# Altium project Metlino.PrjPcb (part 9 of 13)

## Sheet CPU_LPC1776.SchDoc: Metlino
size 420 x 297 mm; CheckedBy: P.Kulik,T.Przywozki,W.Ruclo; Author: G.Kasprowicz; CompanyName: WUT ISE; DrawnBy: G.Kasprowicz; Organization: WUT ISE; Address1: PW ISE; Address2: Nowowiejska 15/19 00-665 Warsaw; Address3: gkasprow@gmail.com; DocumentNumber: 26; Revision: 2; SheetNumber: 26; SheetTotal: 29; ModifiedBy: -; CheckedDate: -; Title2: MMC IO ports; DivGrp: WUT ISE; Designer: G.Kasprowicz; ModifiedDate: -; ProjectName: Sensor Box
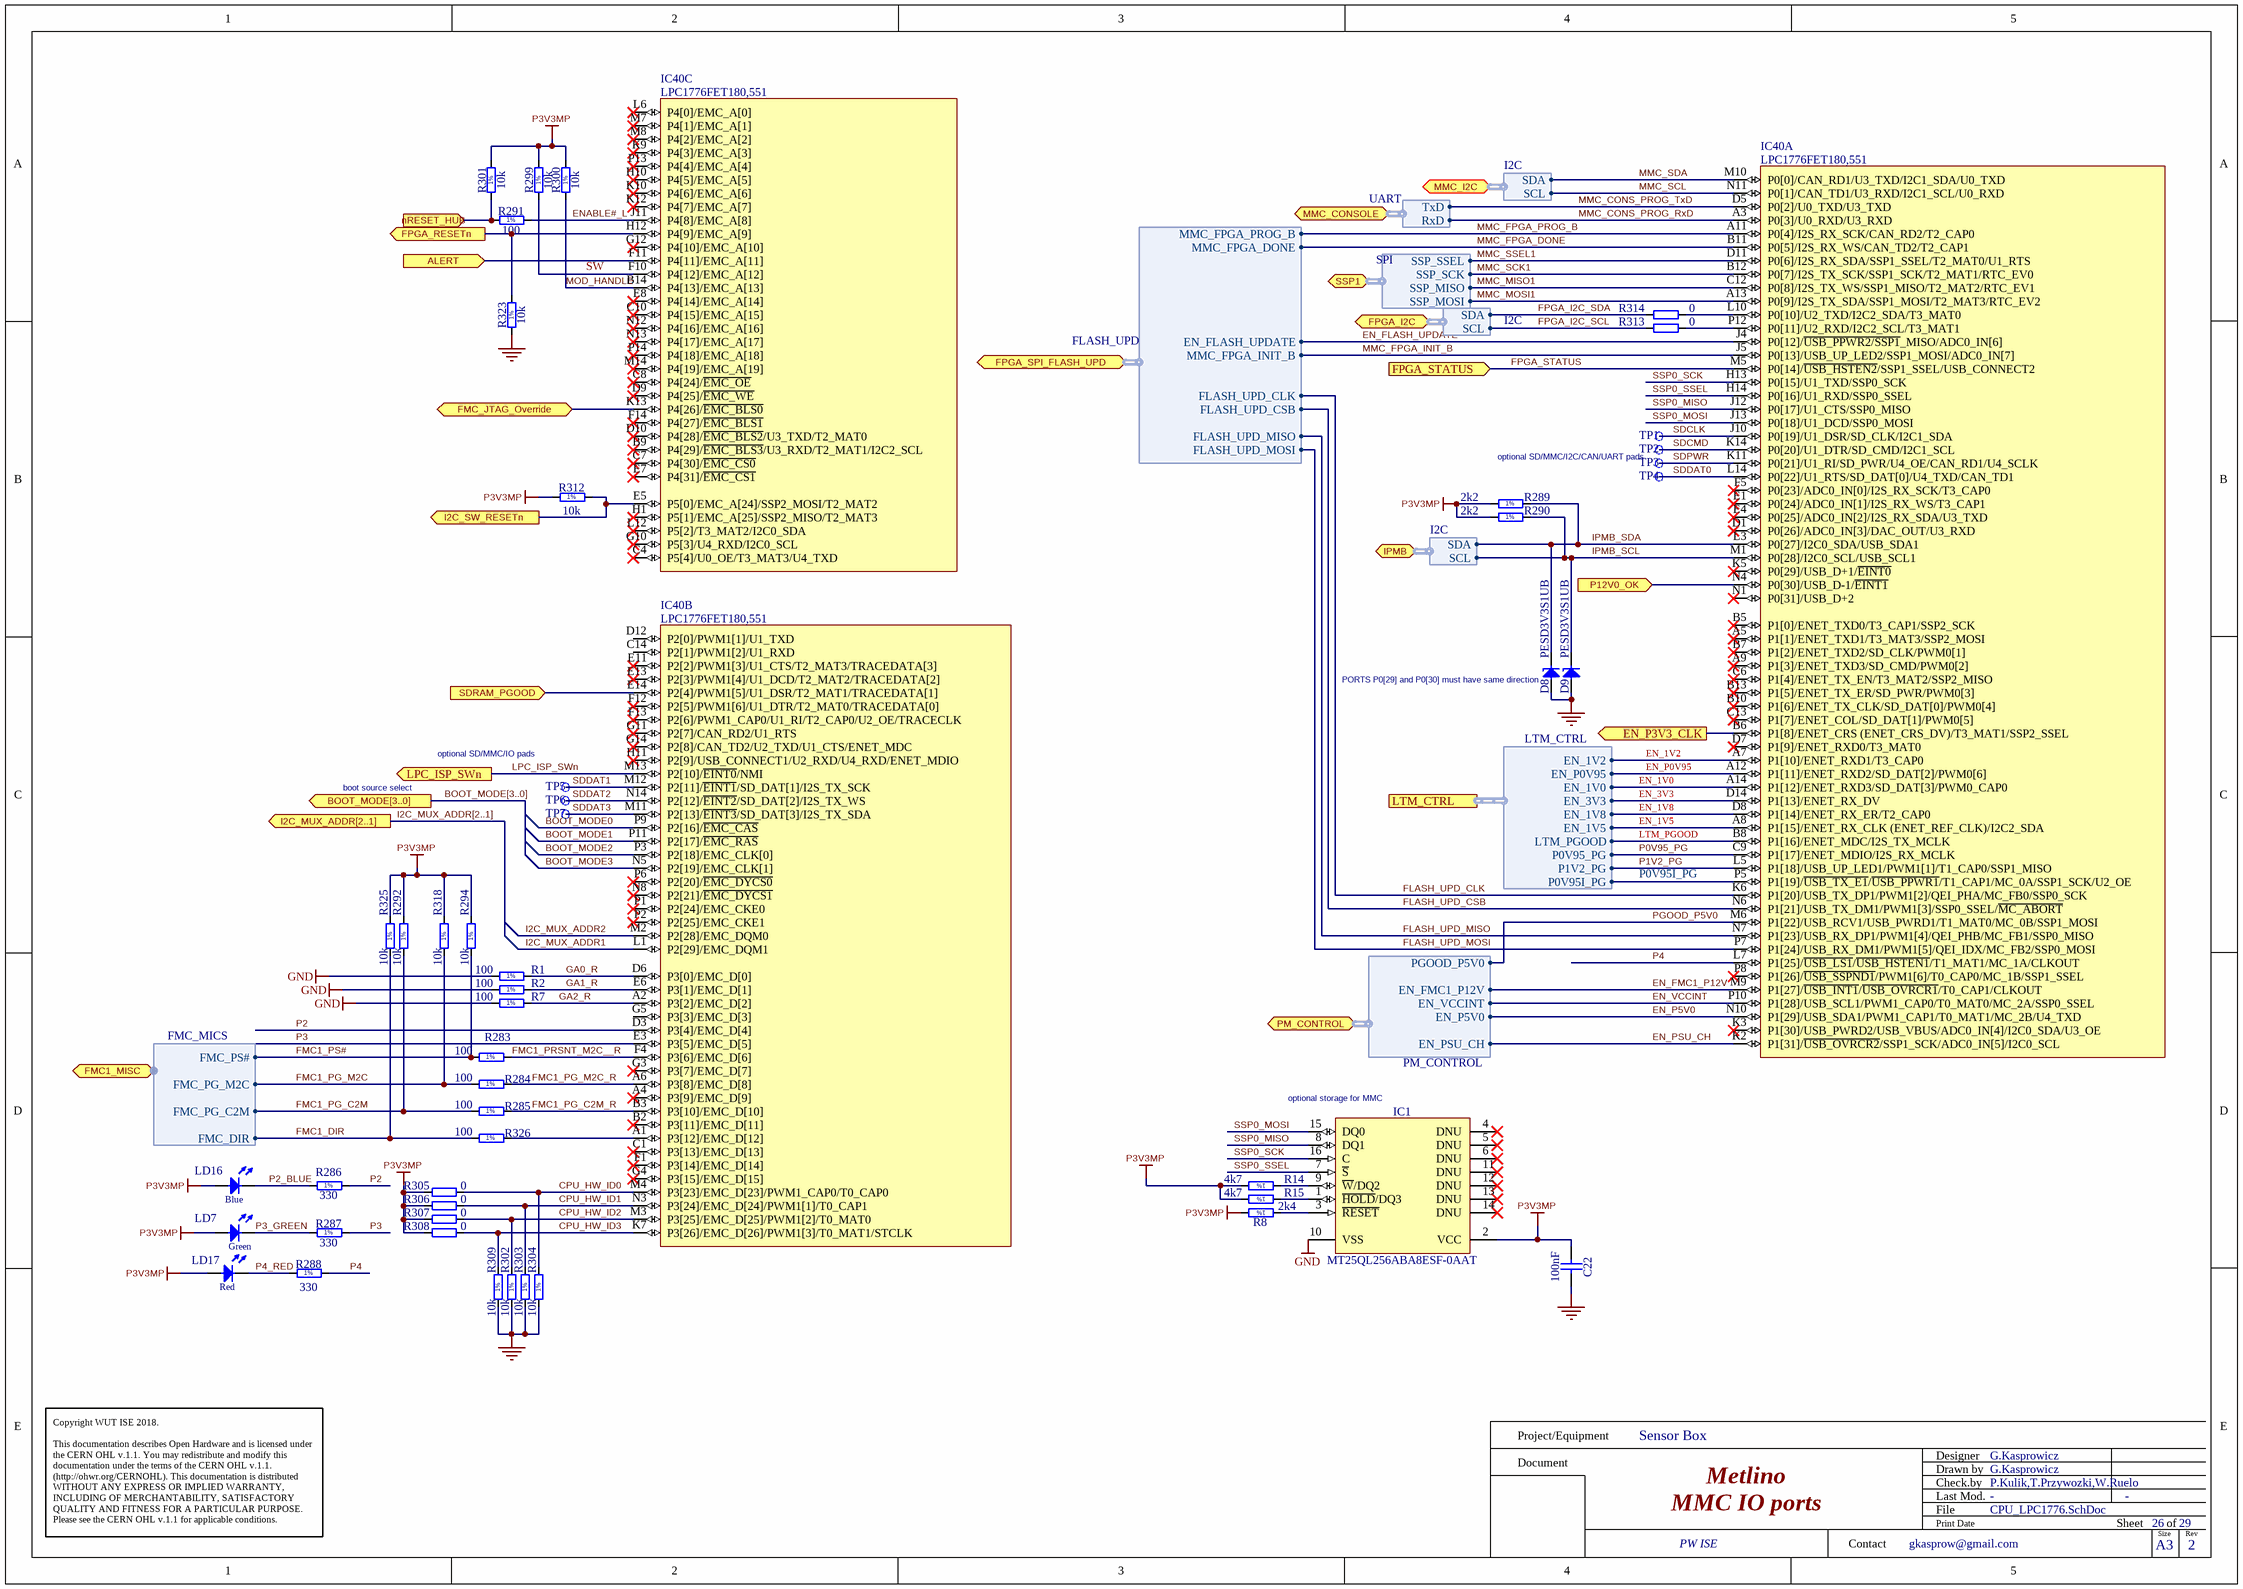
[diagram p18: CPU_LPC1776.SchDoc]

### Parts
C22  100nF  [CAPC0603X33N]
D8  PESD3V3S1UB  [SODFL1608X65N]
D9  PESD3V3S1UB  [SODFL1608X65N]
IC1  MT25QL256ABA8ESF-0AAT  [SOIC127P1030X265-16N]
IC40  LPC1776FET180,551  [BGA180C80P14X14_1200X1200X120]  (parts A,B,C of 5)
LD7  Green  [LED_AVAGO_HSME-C120]
LD16  Blue  [LED_AVAGO_HSMR-C120]  (value not drawn)
LD17  Red  [LED_KINGBRIGHT_KPH-1608SURCK]
R1  100  [RESC1005X40N]
R2  100  [RESC1005X40N]
R7  100  [RESC1005X40N]
R8  2k4  [RESC1005X40N]
R14  4k7  [RESC1005X40N]
R15  4k7  [RESC1005X40N]
R283  100  [RESC1005X40N]
R284  100  [RESC1005X40N]
R285  100  [RESC1005X40N]
R286  330  [RESC1005X40N]
R287  330  [RESC1005X40N]
R288  330  [RESC1005X40N]
R289  2k2  [RESC1005X40N]
R290  2k2  [RESC1005X40N]
R291  100  [RESC1005X40N]
R292  10k  [RESC1005X40N]
R294  10k  [RESC1005X40N]
R299  10k  [RESC1005X40N]
R300  10k  [RESC1005X40N]
R301  10k  [RESC1005X40N]
R302  10k  [RESC1005X40N]
R303  10k  [RESC1005X40N]
R304  10k  [RESC1005X40N]
R305  0  [RESC1005X40N]
R306  0  [RESC1005X40N]
R307  0  [RESC1005X40N]
R308  0  [RESC1005X40N]
R309  10k  [RESC1005X40N]
R312  10k  [RESC1005X40N]
R313  0  [RESC1005X40N]
R314  0  [RESC1005X40N]
R318  10k  [RESC1005X40N]
R323  10k  [RESC1005X40N]
R325  10k  [RESC1005X40N]
R326  100  [RESC1005X40N]
TP1  SMD_PAD_D1MM  [C100]  (value not drawn)
TP2  SMD_PAD_D1MM  [C100]  (value not drawn)
TP3  SMD_PAD_D1MM  [C100]  (value not drawn)
TP4  SMD_PAD_D1MM  [C100]  (value not drawn)
TP5  SMD_PAD_D1MM  [C100]  (value not drawn)
TP6  SMD_PAD_D1MM  [C100]  (value not drawn)
TP7  SMD_PAD_D1MM  [C100]  (value not drawn)

### Ports
ALERT (in), BOOT_MODE[3..0] (out), EN_P3V3_CLK (out), FMC1_MISC (bidir, harness FMC_MICS), FMC_JTAG_Override (bidir), FPGA_I2C (bidir, harness I2C), FPGA_RESETn (out), FPGA_SPI_FLASH_UPD (bidir, harness FLASH_UPD), FPGA_STATUS (in), I2C_MUX_ADDR[2..1] (out), I2C_SW_RESETn (out), IPMB (bidir, harness I2C), LPC_ISP_SWn (out), LTM_CTRL (harness LTM_CTRL), MMC_CONSOLE (bidir, harness UART), MMC_I2C (bidir, harness I2C), nRESET_HUB (in), P12V0_OK (in), PM_CONTROL (bidir, harness PM_CONTROL), SDRAM_PGOOD (in), SSP1 (bidir, harness SPI)

### Harnesses
FMC_MICS: FMC_PS#, FMC_PG_M2C, FMC_PG_C2M, FMC_DIR
I2C: SCL, SDA
FLASH_UPD: MMC_FPGA_PROG_B, MMC_FPGA_DONE, EN_FLASH_UPDATE, MMC_FPGA_INIT_B, FLASH_UPD_CLK, FLASH_UPD_CSB, FLASH_UPD_MISO, FLASH_UPD_MOSI
PM_CONTROL: PGOOD_P5V0, EN_FMC1_P12V, EN_VCCINT, EN_P5V0, EN_PSU_CH
UART: RxD, TxD
SPI: SSP_SCK, SSP_SSEL, SSP_MISO, SSP_MOSI
LTM_CTRL: EN_1V0, EN_3V3, EN_1V8, EN_1V5, LTM_PGOOD, EN_1V2, EN_P0V95, P1V2_PG, P0V95I_PG, P0V95_PG

### Nets
GND: C22.1 D8.2(A) D9.2(A) IC1.10(VSS) R1.1 R2.1 R7.1 R302.1 R303.1 R304.1 R309.1 R323.1
P3V3MP: C22.2 IC1.2(VCC) LD7.2(A) LD16.2(A) LD17.2(A) R8.2 R14.2 R15.2 R289.1 R290.1 R292.2 R294.2 R299.2 R300.2 R301.2 R305.1 R306.1 R307.1 R308.1 R312.1 R318.2 R325.2
BOOT_MODE0: IC40.P9(P2[16]/~{EMC_CAS})
BOOT_MODE1: IC40.P11(P2[17]/~{EMC_RAS})
BOOT_MODE2: IC40.P3(P2[18]/EMC_CLK[0])
BOOT_MODE3: IC40.N5(P2[19]/EMC_CLK[1])
CPU_HW_ID0: IC40.M4(P3[23]/EMC_D[23]/PWM1_CAP0/T0_CAP0) R304.2 R305.2
CPU_HW_ID1: IC40.N3(P3[24]/EMC_D[24]/PWM1[1]/T0_CAP1) R303.2 R306.2
CPU_HW_ID2: IC40.M3(P3[25]/EMC_D[25]/PWM1[2]/T0_MAT0) R302.2 R307.2
CPU_HW_ID3: IC40.K7(P3[26]/EMC_D[26]/PWM1[3]/T0_MAT1/STCLK) R308.2 R309.2
EN_1V0: IC40.A14(P1[12]/ENET_RXD3/SD_DAT[3]/PWM0_CAP0) ; port LTM_CTRL.EN_1V0
EN_1V2: IC40.A7(P1[10]/ENET_RXD1/T3_CAP0) ; port LTM_CTRL.EN_1V2
EN_1V5: IC40.A8(P1[15]/ENET_RX_CLK_(ENET_REF_CLK)/I2C2_SDA) ; port LTM_CTRL.EN_1V5
EN_1V8: IC40.D8(P1[14]/ENET_RX_ER/T2_CAP0) ; port LTM_CTRL.EN_1V8
EN_3V3: IC40.D14(P1[13]/ENET_RX_DV) ; port LTM_CTRL.EN_3V3
EN_FLASH_UPDATE: IC40.J4(P0[12]/~{USB_PPWR2/SSP1}_MISO/ADC0_IN[6]) ; port FPGA_SPI_FLASH_UPD.EN_FLASH_UPDATE
EN_FMC1_P12V: IC40.M9(P1[27]/~{USB_INT1}/~{USB_OVRCR1}/T0_CAP1/CLKOUT) ; port PM_CONTROL.EN_FMC1_P12V
EN_P0V95: IC40.A12(P1[11]/ENET_RXD2/SD_DAT[2]/PWM0[6]) ; port LTM_CTRL.EN_P0V95
EN_P5V0: IC40.N10(P1[29]/USB_SDA1/PWM1_CAP1/T0_MAT1/MC_2B/U4_TXD) ; port PM_CONTROL.EN_P5V0
EN_PSU_CH: IC40.K2(P1[31]/~{USB_OVRCR2}/SSP1_SCK/ADC0_IN[5]/I2C0_SCL) ; port PM_CONTROL.EN_PSU_CH
EN_VCCINT: IC40.P10(P1[28]/USB_SCL1/PWM1_CAP0/T0_MAT0/MC_2A/SSP0_SSEL) ; port PM_CONTROL.EN_VCCINT  [project net EN_P0V9]
ENABLE#_L: IC40.J11(P4[8]/EMC_A[8]) R291.2
FLASH_UPD_CLK: IC40.K6(P1[20]/USB_TX_DP1/PWM1[2]/QEI_PHA/MC_FB0/SSP0_SCK) ; port FPGA_SPI_FLASH_UPD.FLASH_UPD_CLK
FLASH_UPD_CSB: IC40.N6(P1[21]/USB_TX_DM1/PWM1[3]/SSP0_SSEL/~{MC_ABORT}) ; port FPGA_SPI_FLASH_UPD.FLASH_UPD_CSB
FLASH_UPD_MISO: IC40.N7(P1[23]/USB_RX_DP1/PWM1[4]/QEI_PHB/MC_FB1/SSP0_MISO) ; port FPGA_SPI_FLASH_UPD.FLASH_UPD_MISO
FLASH_UPD_MOSI: IC40.P7(P1[24]/USB_RX_DM1/PWM1[5]/QEI_IDX/MC_FB2/SSP0_MOSI) ; port FPGA_SPI_FLASH_UPD.FLASH_UPD_MOSI
FMC1_DIR: R325.1 R326.1 ; port FMC1_MISC.FMC_DIR  [project net CLK_DIR]
FMC1_PG_C2M: R285.1 R292.1 ; port FMC1_MISC.FMC_PG_C2M  [project net FMC1_MISC.FMC_PG_C2M]
FMC1_PG_C2M_R: IC40.B3(P3[10]/EMC_D[10]) R285.2
FMC1_PG_M2C: R284.1 R318.1 ; port FMC1_MISC.FMC_PG_M2C  [project net FMC1_MISC.FMC_PG_M2C]
FMC1_PG_M2C_R: IC40.A6(P3[8]/EMC_D[8]) R284.2
FMC1_PRSNT_M2C__R: IC40.F4(P3[6]/EMC_D[6]) R283.2
FMC1_PS#: R283.1 R294.1 ; port FMC1_MISC.FMC_PS#  [project net FMC1_MISC.FMC_PS#]
FPGA_I2C_SCL: R313.1 ; port FPGA_I2C.SCL
FPGA_I2C_SDA: R314.1 ; port FPGA_I2C.SDA
FPGA_RESETn: IC40.H12(P4[9]/EMC_A[9]) R323.2 ; port FPGA_RESETn
FPGA_STATUS: IC40.M5(P0[14]/~{USB_HSTEN2}/SSP1_SSEL/USB_CONNECT2) ; port FPGA_STATUS
GA0_R: IC40.D6(P3[0]/EMC_D[0]) R1.2
GA1_R: IC40.E6(P3[1]/EMC_D[1]) R2.2
GA2_R: IC40.A2(P3[2]/EMC_D[2]) R7.2
I2C_MUX_ADDR1: IC40.L1(P2[29]/EMC_DQM1)
I2C_MUX_ADDR2: IC40.M2(P2[28]/EMC_DQM0)
I2C_SW_RESETn: IC40.E5(P5[0]/EMC_A[24]/SSP2_MOSI/T2_MAT2) R312.2 ; port I2C_SW_RESETn
IPMB_SCL: D9.1(C) IC40.M1(P0[28]/I2C0_SCL/USB_SCL1) R290.2 ; port IPMB.SCL
IPMB_SDA: D8.1(C) IC40.L3(P0[27]/I2C0_SDA/USB_SDA1) R289.2 ; port IPMB.SDA
LPC_ISP_SWn: IC40.M13(P2[10]/~{EINT0}/NMI) ; port LPC_ISP_SWn
LTM_PGOOD: IC40.B8(P1[16]/ENET_MDC/I2S_TX_MCLK) ; port LTM_CTRL.LTM_PGOOD
MMC_CONS_PROG_RxD: IC40.A3(P0[3]/U0_RXD/U3_RXD) ; port MMC_CONSOLE.RxD
MMC_CONS_PROG_TxD: IC40.D5(P0[2]/U0_TXD/U3_TXD) ; port MMC_CONSOLE.TxD
MMC_FPGA_DONE: IC40.B11(P0[5]/I2S_RX_WS/CAN_TD2/T2_CAP1) ; port FPGA_SPI_FLASH_UPD.MMC_FPGA_DONE
MMC_FPGA_INIT_B: IC40.J5(P0[13]/USB_UP_LED2/SSP1_MOSI/ADC0_IN[7]) ; port FPGA_SPI_FLASH_UPD.MMC_FPGA_INIT_B
MMC_FPGA_PROG_B: IC40.A11(P0[4]/I2S_RX_SCK/CAN_RD2/T2_CAP0) ; port FPGA_SPI_FLASH_UPD.MMC_FPGA_PROG_B
MMC_MISO1: IC40.C12(P0[8]/I2S_TX_WS/SSP1_MISO/T2_MAT2/RTC_EV1) ; port SSP1.SSP_MISO
MMC_MOSI1: IC40.A13(P0[9]/I2S_TX_SDA/SSP1_MOSI/T2_MAT3/RTC_EV2) ; port SSP1.SSP_MOSI
MMC_SCK1: IC40.B12(P0[7]/I2S_TX_SCK/SSP1_SCK/T2_MAT1/RTC_EV0) ; port SSP1.SSP_SCK
MMC_SCL: IC40.N11(P0[1]/CAN_TD1/U3_RXD/I2C1_SCL/U0_RXD) ; port MMC_I2C.SCL
MMC_SDA: IC40.M10(P0[0]/CAN_RD1/U3_TXD/I2C1_SDA/U0_TXD) ; port MMC_I2C.SDA
MMC_SSEL1: IC40.D11(P0[6]/I2S_RX_SDA/SSP1_SSEL/T2_MAT0/U1_RTS) ; port SSP1.SSP_SSEL
MOD_HANDLE: IC40.B14(P4[13]/EMC_A[13]) R300.1
MRnR: R291.1 R301.1 ; port nRESET_HUB
P0V95_PG: IC40.C9(P1[17]/ENET_MDIO/I2S_RX_MCLK) ; port LTM_CTRL.P0V95_PG
P0V95I_PG: IC40.P5(P1[19]/~{USB_TX_E1}/~{USB_PPWR1}/T1_CAP1/MC_0A/SSP1_SCK/U2_OE) ; port LTM_CTRL.P0V95I_PG
P1V2_PG: IC40.L5(P1[18]/USB_UP_LED1/PWM1[1]/T1_CAP0/SSP1_MISO) ; port LTM_CTRL.P1V2_PG
P2: IC40.D3(P3[4]/EMC_D[4]) R286.2
P2_BLUE: LD16.1(C) R286.1
P3: IC40.E3(P3[5]/EMC_D[5]) R287.2
P3_GREEN: LD7.1(C) R287.1
P4: IC40.L7(P1[25]/~{USB_LS1}/~{USB_HSTEN1}/T1_MAT1/MC_1A/CLKOUT) R288.2
P4_RED: LD17.1(C) R288.1
P12V0_OK: IC40.N4(P0[30]/USB_D-1/~{EINT1}) ; port P12V0_OK
PGOOD: IC40.E14(P2[4]/PWM1[5]/U1_DSR/T2_MAT1/TRACEDATA[1]) ; port SDRAM_PGOOD
PGOOD_P5V0: IC40.M6(P1[22]/USB_RCV1/USB_PWRD1/T1_MAT0/MC_0B/SSP1_MOSI) ; port PM_CONTROL.PGOOD_P5V0
SDCLK: IC40.J10(P0[19]/U1_DSR/SD_CLK/I2C1_SDA) TP1.1
SDCMD: IC40.K14(P0[20]/U1_DTR/SD_CMD/I2C1_SCL) TP2.1
SDDAT0: IC40.L14(P0[22]/U1_RTS/SD_DAT[0]/U4_TXD/CAN_TD1) TP4.1
SDDAT1: IC40.M12(P2[11]/~{EINT1}/SD_DAT[1]/I2S_TX_SCK) TP5.1
SDDAT2: IC40.N14(P2[12]/~{EINT2}/SD_DAT[2]/I2S_TX_WS) TP6.1
SDDAT3: IC40.M11(P2[13]/~{EINT3}/SD_DAT[3]/I2S_TX_SDA) TP7.1
SDPWR: IC40.K11(P0[21]/U1_RI/SD_PWR/U4_OE/CAN_RD1/U4_SCLK) TP3.1
SSP0_MISO: IC1.8(DQ1) IC40.J12(P0[17]/U1_CTS/SSP0_MISO)
SSP0_MOSI: IC1.15(DQ0) IC40.J13(P0[18]/U1_DCD/SSP0_MOSI)
SSP0_SCK: IC1.16(C) IC40.H13(P0[15]/U1_TXD/SSP0_SCK)
SSP0_SSEL: IC1.7(~{S}) IC40.H14(P0[16]/U1_RXD/SSP0_SSEL)
SW: IC40.F10(P4[12]/EMC_A[12]) R299.1
NetIC1_1: IC1.1(~{HOLD}/DQ3) R15.1
NetIC1_3: IC1.3(~{RESET}) R8.1
NetIC1_9: IC1.9(~{W}/DQ2) R14.1
NetIC13_4: IC40.K13(P4[26]/~{EMC_BLS0}) ; port FMC_JTAG_Override
NetIC17_1: IC40.B6(P1[8]/ENET_CRS_(ENET_CRS_DV)/T3_MAT1/SSP2_SSEL) ; port EN_P3V3_CLK
NetIC34_3: IC40.F11(P4[11]/EMC_A[11]) ; port ALERT
NetIC40_A1: IC40.A1(P3[12]/EMC_D[12]) R326.2
NetIC40_L10: IC40.L10(P0[10]/U2_TXD/I2C2_SDA/T3_MAT0) R314.2
NetIC40_P12: IC40.P12(P0[11]/U2_RXD/I2C2_SCL/T3_MAT1) R313.2

Not connected (* = marked no-connect by the designer): IC1 4(DNU)* 5(DNU)* 6(DNU)* 11(DNU)* 12(DNU)* 13(DNU)* 14(DNU)*; IC40 A4(P3[9]/EMC_D[9])* A5(P1[1]/ENET_TXD1/T3_MAT3/SSP2_MOSI)* A9(P1[3]/ENET_TXD3/SD_CMD/PWM0[2])* B2(P3[11]/EMC_D[11])* B5(P1[0]/ENET_TXD0/T3_CAP1/SSP2_SCK)* B7(P1[2]/ENET_TXD2/SD_CLK/PWM0[1])* B9(P4[29]/~{EMC_BLS3}/U3_RXD/T2_MAT1/I2C2_SCL)* B10(P1[6]/ENET_TX_CLK/SD_DAT[0]/PWM0[4])* B13(P1[5]/ENET_TX_ER/SD_PWR/PWM0[3])* C1(P3[13]/EMC_D[13])* C4(P5[4]/U0_OE/T3_MAT3/U4_TXD)* C6(P1[4]/ENET_TX_EN/T3_MAT2/SSP2_MISO)* C7(P4[30]/~{EMC_CS0})* C8(P4[24]/~{EMC_OE})* C10(P4[15]/EMC_A[15])* C13(P1[7]/ENET_COL/SD_DAT[1]/PWM0[5])* C14(P2[1]/PWM1[2]/U1_RXD) D1(P0[26]/ADC0_IN[3]/DAC_OUT/U3_RXD)* D7(P1[9]/ENET_RXD0/T3_MAT0)* D9(P4[25]/~{EMC_WE})* D10(P4[28]/~{EMC_BLS2}/U3_TXD/T2_MAT0)* D12(P2[0]/PWM1[1]/U1_TXD) E1(P0[24]/ADC0_IN[1]/I2S_RX_WS/T3_CAP1)* E4(P0[25]/ADC0_IN[2]/I2S_RX_SDA/U3_TXD)* E7(P4[31]/~{EMC_CS1})* E8(P4[14]/EMC_A[14])* E11(P2[2]/PWM1[3]/U1_CTS/T2_MAT3/TRACEDATA[3])* E13(P2[3]/PWM1[4]/U1_DCD/T2_MAT2/TRACEDATA[2])* F1(P3[14]/EMC_D[14])* F5(P0[23]/ADC0_IN[0]/I2S_RX_SCK/T3_CAP0)* F12(P2[5]/PWM1[6]/U1_DTR/T2_MAT0/TRACEDATA[0])* F13(P2[6]/PWM1_CAP0/U1_RI/T2_CAP0/U2_OE/TRACECLK)* F14(P4[27]/~{EMC_BLS1})* G3(P3[7]/EMC_D[7])* G4(P3[15]/EMC_D[15])* G5(P3[3]/EMC_D[3]) G10(P5[3]/U4_RXD/I2C0_SCL)* G11(P2[7]/CAN_RD2/U1_RTS)* G12(P4[10]/EMC_A[10])* G14(P2[8]/CAN_TD2/U2_TXD/U1_CTS/ENET_MDC)* H1(P5[1]/EMC_A[25]/SSP2_MISO/T2_MAT3)* H10(P4[5]/EMC_A[5])* H11(P2[9]/USB_CONNECT1/U2_RXD/U4_RXD/ENET_MDIO)* K3(P1[30]/USB_PWRD2/USB_VBUS/ADC0_IN[4]/I2C0_SDA/U3_OE)* K5(P0[29]/USB_D+1/~{EINT0})* K9(P4[3]/EMC_A[3])* K10(P4[6]/EMC_A[6])* K12(P4[7]/EMC_A[7])* L6(P4[0]/EMC_A[0])* L12(P5[2]/T3_MAT2/I2C0_SDA)* M7(P4[1]/EMC_A[1])* M8(P4[2]/EMC_A[2])* M14(P4[19]/EMC_A[19])* N1(P0[31]/USB_D+2)* N8(P2[21]/~{EMC_DYCS1})* N12(P4[16]/EMC_A[16])* N13(P4[17]/EMC_A[17])* P1(P2[24]/EMC_CKE0)* P2(P2[25]/EMC_CKE1)* P6(P2[20]/~{EMC_DYCS0})* P8(P1[26]/~{USB_SSPND1}/PWM1[6]/T0_CAP0/MC_1B/SSP1_SSEL)* P13(P4[4]/EMC_A[4])* P14(P4[18]/EMC_A[18])*

### Buses and harness runs
bus BOOT_MODE[3..0] = port BOOT_MODE[3..0]
bus I2C_MUX_ADDR[2..1] = port I2C_MUX_ADDR[2..1]

### Notes on the sheet
- optional SD/MMC/I2C/CAN/UART pads
- (near D8) PORTS P0[29] and P0[30] must have same direction
- boot source select
- optional SD/MMC/IO pads
- (near IC1) optional storage for MMC
- Project/Equipment
- Document
- Designer
- Drawn by
- Check.by
- Copyright WUT ISE 2018.
  This documentation describes Open Hardware and is licensed under the CERN OHL v.1.1. You may redistribute and modify this documentation under the terms of the CERN OHL v.1.1. (http://ohwr.org/CERNOHL). This documentation is distributed WITHOUT ANY EXPRESS OR IMPLIED WARRANTY, INCLUDING OF MERCHANTABILITY, SATISFACTORY QUALITY AND FITNESS FOR A PARTICULAR PURPOSE. Please see the CERN OHL v.1.1 for applicable conditions.
- Contact
- File
- Last Mod.
- Print Date
- Sheet
- Size
- A3
- of
- Rev
- (in symbol R0402_2K2_1%_0.0625W_100PPM) 1%
- (in symbol R0402_2K4_1%_0.0625W_100PPM) 1%
- (in symbol R0402_4K7_1%_0.0625W_100PPM) 1%
- (in symbol R0402_10K_1%_0.0625W_100PPM) 1%
- (in symbol R0402_100R_1%_0.1W_100PPM) 1%
- (in symbol R0402_330R_1%_0.0625W_100PPM) 1%

### Library data of the parts
C22 = CC0201_100NF_6.3V_10%_X5R: Non-polarised capacitor; Manufacturer: GENERIC; Part Description: SMD Multilayer Chip Ceramic Capacitor; Manufacturer1 Part Number: 02016D104KAT2A; Tolerance: ±10%; Voltage: 6.3V; TC: X5R; Manufacturer Part Number: CC0201_100NF_6.3V_10%_X5R; Part Number: CC0201_100NF_6.3V_10%_X5R; Value: 100nF; Component Kind: Standard; Component Type: Standard; Pin Count: 2; Status: Not Recommended; Case: 0201; Mounted: Yes; Socket: No; SMD: Yes; Sense: No; Manufacturer1 Example: AVX; Manufacturer1 ComponentHeight: 0.33mm; HelpURL: \\cern.ch\dfs\Applications\Altium\Datasheets\CC0201_X5R_AVX.pdf; Author: CERN DEM JLC; CreateDate: 03.12.2007; LatestRevisionDate: 03.12.2007
D8 D9 = PESD3V3S1UB: ESD protection diode; Manufacturer: NXP SEMICONDUCTORS; Part Description: ESD protection diode (23kV); Voltage: 3V3; Power: 330W; PressFit: No; Bonding: No; Manufacturer Part Number: PESD3V3S1UB; PackageDescription: Ultra Small Outline Diode Flat Lead (SOD-523), Body; 1.2mm L X 0.8mm W X 0.65mm H, IPC Medium Density; Part Number: PESD3V3S1UB; Component Kind: Standard; Component Type: Standard; Device: PESD3V3S1UB; Pin Count: 2; Case: SOD523; Mounted: Yes; Socket: No; SMD: Yes; Sense: No; ComponentHeight: 0.65mm; HelpURL: \\cern.ch\dfs\Applications\Altium\Datasheets\PESD3V3S1UB.pdf; Author: CERN DEM JLC; CreateDate: 29.11.2012; LatestRevisionDate: 29.11.2012
IC1 = MT25QL256ABA8ESF-0AAT: 256Mbit (32MB), 2.7V-3.6V, Multiple I/O Serial NOR Flash Memory,with Reset# & Hold#; Part Description: 256Mbit (32MB), 2.7V-3.6V, Multiple I/O Serial NOR Flash Memory,with Reset# & Hold# (Automotive grade AEC-Q100); Manufacturer: MICRON TECHNOLOGY; PressFit: No; Bonding: No; Part Number: MT25QL256ABA8ESF-0AAT; Component Kind: Standard; Component Type: Standard; Device: MT25QL256ABA8ESF-0AAT; PackageDescription: SOIC 16, Pitch 1.27mm - Body 7.5x10.3mm, IPC Medium Density; Manufacturer Part Number: MT25QL256ABA8ESF-0AAT; Pin Count: 16; Case: SOIC16; Mounted: Yes; Socket: No; SMD: Yes; Sense: No; ComponentHeight: 2.65mm; HelpURL: \\cern.ch\dfs\Applications\Altium\Datasheets\MT25QL256ABA8ESF-0AAT.pdf; Author: CERN DEM JLC; CreateDate: 05.11.2018; LatestRevisionDate: 05.11.2018
IC40 = LPC1776FET180,551: 32-bit ARM Cortex-M3 MCU, 256kB Flash, 80kB SRAM, Ethernet, USB 2.0 Device/Host/OTG, CAN, 12-Bit ADC; Manufacturer: NXP SEMICONDUCTORS; Part Description: Cortex-M3, 32-bit ARM MCU, 256kB Flash, 80kB SRAM, Ethernet, USB 2.0 Device/Host/OTG, CAN, 12-Bit ADC; PressFit: No; Bonding: No; Manufacturer Part Number: LPC1776FET180,551; PackageDescription: BGA, 0.80mm Pitch, Square; 180 Pin, 14 Columns X 14 Rows, Body 12.00mm X 12.00mm X 1.20mm H, IPC Medium Density; Part Number: LPC1776FET180,551; Component Kind: Standard; Component Type: Standard; Device: LPC1776FET180,551; Pin Count: 180; Case: BGA180; Mounted: Yes; Socket: No; SMD: Yes; Sense: No; ComponentHeight: 1.2mm; HelpURL: \\cern.ch\dfs\Applications\Altium\Datasheets\LPC1776FET180,551.pdf; Author: CERN DEM JMW; CreateDate: 16.08.2016; LatestRevisionDate: 16.08.2016
LD7 = LED_AVAGO_HSME-C120: as LD9-LD11 on sheet ETH_PHY_RGMII; Manufacturer Part Number: HSME-C120; PackageDescription: Green Chip LED, 2-Leads, Body 1.7x1.1mm, Side Emitting Package; Part Number: LED_AVAGO_HSME-C120; Component Kind: Standard; Component Type: Standard; Color: Green; Pin Count: 2; Mounted: Yes; Socket: No; SMD: Yes; Sense: No; ComponentHeight: 0.7mm; HelpURL: \\cern.ch\dfs\Applications\Altium\Datasheets\LED_AVAGO_HSME-C120.pdf; ComponentLink1URL: \\cern.ch\dfs\Applications\Altium\Datasheets\LED_AVAGO_HSME-C110_DESIGN-GUIDE.pdf; ComponentLink1Description: Design Guide; Author: CERN DEM JMW; CreateDate: 22.07.2009; LatestRevisionDate: 20.06.2012
LD16 = LED_AVAGO_HSMR-C120: LED Blue 1C 2A; Manufacturer: AVAGO TECHNOLOGIES; Part Description: High Performance Right Angle Chip InGaN Blue LED; PressFit: No; Bonding: No; Manufacturer Part Number: HSMR-C120; PackageDescription: Blue Chip LED, 2-Leads, Body 1.7x1.1mm, Side Emitting Package; Part Number: LED_AVAGO_HSMR-C120; Component Kind: Standard; Component Type: Standard; Color: Blue; Pin Count: 2; Mounted: Yes; Socket: No; SMD: Yes; Sense: No; ComponentHeight: 0.7mm; HelpURL: \\cern.ch\dfs\Applications\Altium\Datasheets\LED_AVAGO_HSMR-C120.pdf; Author: CERN DEM JLC; CreateDate: 07.07.2014; LatestRevisionDate: 07.07.2014
LD17 = LED_KINGBRIGHT_KPH-1608SURCK: LED Red 1C 2A; Part Description: SMD Hyper Red LED, Case 1.6mmX0.8mm(0603), 0.65mm Thickness; PressFit: No; Bonding: No; Part Number: LED_KINGBRIGHT_KPH-1608SURCK; Component Kind: Standard; Component Type: Standard; Color: Red; PackageDescription: SMT Hyper Red LED, Case 0603, Body L 1.6 x W 0.8mm H 0.65mm; Manufacturer: KINGBRIGHT; Manufacturer Part Number: KPH-1608SURCK; Pin Count: 2; Mounted: Yes; Socket: No; SMD: Yes; Sense: No; ComponentHeight: 0.65mm; HelpURL: \\cern.ch\dfs\Applications\Altium\Datasheets\LED_KINGBRIGHT_KPH-1608SURCK.pdf; Author: CERN DEM JLC; CreateDate: 03.07.2017; LatestRevisionDate: 03.07.2017
R1 R2 R7 R283-R285 R291 R326 = R0402_100R_1%_0.1W_100PPM: Resistor - 1%; Manufacturer Part Number: R0402_100R_1%_0.1W_100PPM_50V; Manufacturer: GENERIC; Part Description: General Purpose Thick Film Chip Resistor; Manufacturer1 Part Number: ERJ2RKF1000X; Power: 0.1W; TC: ±100ppm/°C; Voltage: 50V; PressFit: No; Part Number: R0402_100R_1%_0.1W_100PPM; Tolerance: ±1%; Value: 100; Component Kind: Standard; Component Type: Standard; Pin Count: 2; Status: Not Recommended; Case: 0402; Mounted: Yes; Sense: No; Socket: No; SMD: Yes; Manufacturer1 Example: PANASONIC; Manufacturer1 ComponentHeight: 0.4mm; HelpURL: \\cern.ch\dfs\Applications\Altium\Datasheets\R0402_PANASONIC_ERJ2RK.pdf; Author: CERN DEM JLC; CreateDate: 12.12.2013; LatestRevisionDate: 03.03.2015
R8 = R0402_2K4_1%_0.0625W_100PPM: Resistor - 1%; Manufacturer: GENERIC; Part Description: General Purpose Thick Film Chip Resistor; Manufacturer1 Part Number: 232270672402L; TC: ±100ppm/°C; PressFit: No; Manufacturer Part Number: R0402_2K4_1%_0.0625W_100PPM; Part Number: R0402_2K4_1%_0.0625W_100PPM; Tolerance: ±1%; Value: 2k4; Component Kind: Standard; Component Type: Standard; Pin Count: 2; Status: Not Recommended; Power: 0.0625W; Case: 0402; Mounted: Yes; Sense: No; Socket: No; SMD: Yes; Manufacturer1 Example: YAGEO PHYCOMP; Manufacturer1 ComponentHeight: 0.4mm; HelpURL: \\cern.ch\dfs\Applications\Altium\Datasheets\R0402_Phycomp_RC0402.pdf; Author: CERN DEM JLC; CreateDate: 03.12.2007; LatestRevisionDate: 17.10.2012
R14 R15 = R0402_4K7_1%_0.0625W_100PPM: Resistor - 1%; Manufacturer: GENERIC; Part Description: General Purpose Thick Film Chip Resistor; Manufacturer1 Part Number: 232270674702L; TC: ±100ppm/°C; PressFit: No; Manufacturer Part Number: R0402_4K7_1%_0.0625W_100PPM; Part Number: R0402_4K7_1%_0.0625W_100PPM; Tolerance: ±1%; Value: 4k7; Component Kind: Standard; Component Type: Standard; Pin Count: 2; Status: Not Recommended; Power: 0.0625W; Case: 0402; Mounted: Yes; Sense: No; Socket: No; SMD: Yes; Manufacturer1 Example: YAGEO PHYCOMP; Manufacturer1 ComponentHeight: 0.4mm; HelpURL: \\cern.ch\dfs\Applications\Altium\Datasheets\R0402_Phycomp_RC0402.pdf; Author: CERN DEM JLC; CreateDate: 03.12.2007; LatestRevisionDate: 17.10.2012
R286-R288 = R0402_330R_1%_0.0625W_100PPM: Resistor - 1%; Manufacturer: GENERIC; Part Description: General Purpose Thick Film Chip Resistor; Manufacturer1 Part Number: 232270673301L; TC: ±100ppm/°C; PressFit: No; Manufacturer Part Number: R0402_330R_1%_0.0625W_100PPM; Part Number: R0402_330R_1%_0.0625W_100PPM; Tolerance: ±1%; Value: 330; Component Kind: Standard; Component Type: Standard; Pin Count: 2; Status: Not Recommended; Power: 0.0625W; Case: 0402; Mounted: Yes; Sense: No; Socket: No; SMD: Yes; Manufacturer1 Example: YAGEO PHYCOMP; Manufacturer1 ComponentHeight: 0.4mm; HelpURL: \\cern.ch\dfs\Applications\Altium\Datasheets\R0402_Phycomp_RC0402.pdf; Author: CERN DEM JLC; CreateDate: 03.12.2007; LatestRevisionDate: 17.10.2012
R289 R290 = R0402_2K2_1%_0.0625W_100PPM: Resistor - 1%; Manufacturer: GENERIC; Part Description: General Purpose Thick Film Chip Resistor; Manufacturer1 Part Number: 232270672202L; TC: ±100ppm/°C; PressFit: No; Manufacturer Part Number: R0402_2K2_1%_0.0625W_100PPM; Part Number: R0402_2K2_1%_0.0625W_100PPM; Tolerance: ±1%; Value: 2k2; Component Kind: Standard; Component Type: Standard; Pin Count: 2; Status: Not Recommended; Power: 0.0625W; Case: 0402; Mounted: Yes; Sense: No; Socket: No; SMD: Yes; Manufacturer1 Example: YAGEO PHYCOMP; Manufacturer1 ComponentHeight: 0.4mm; HelpURL: \\cern.ch\dfs\Applications\Altium\Datasheets\R0402_Phycomp_RC0402.pdf; Author: CERN DEM JLC; CreateDate: 03.12.2007; LatestRevisionDate: 17.10.2012
R292 R294 R299-R304 R309 R312 R318 R323 R325 = R0402_10K_1%_0.0625W_100PPM: Resistor - 1%; Manufacturer: GENERIC; Part Description: General Purpose Thick Film Chip Resistor; Manufacturer1 Part Number: 232270671003L; TC: ±100ppm/°C; PressFit: No; Manufacturer Part Number: R0402_10K_1%_0.0625W_100PPM; Part Number: R0402_10K_1%_0.0625W_100PPM; Tolerance: ±1%; Value: 10k; Component Kind: Standard; Component Type: Standard; Pin Count: 2; Status: Not Recommended; Power: 0.0625W; Case: 0402; Mounted: Yes; Sense: No; Socket: No; SMD: Yes; Manufacturer1 Example: YAGEO PHYCOMP; Manufacturer1 ComponentHeight: 0.4mm; HelpURL: \\cern.ch\dfs\Applications\Altium\Datasheets\R0402_Phycomp_RC0402.pdf; Author: CERN DEM JLC; CreateDate: 03.12.2007; LatestRevisionDate: 17.10.2012
R305-R308 R313 R314 = R0402_0R_JUMPER: Resistor; Manufacturer: GENERIC; Part Description: 1A (0.05R Max DC Resistance) Zero Ohm Jumper; Manufacturer1 Part Number: 232270591001L; PressFit: No; Manufacturer Part Number: R0402_0R_JUMPER; Part Number: R0402_0R_JUMPER; Value: 0; Component Kind: Standard; Component Type: Standard; Pin Count: 2; Status: Not Recommended; Case: 0402; Mounted: Yes; Sense: No; Socket: No; SMD: Yes; Manufacturer1 Example: YAGEO PHYCOMP; Manufacturer1 ComponentHeight: 0.4mm; HelpURL: \\cern.ch\dfs\Applications\Altium\Datasheets\R0402_Phycomp_RC0402.pdf; Author: CERN DEM JLC; CreateDate: 03.12.2007; LatestRevisionDate: 17.10.2012
TP1 = C100: $$NotCommonProperty_Partition: Pads; Part Description: 1mm Diameter SMD Pad; $$Internal_Resolution: 00001mm; $$NotCommonProperty_Family: SMD Pad; $$NotCommonProperty_Mounted: No; $$NotCommonProperty_Pin Count: 1; $$NotCommonProperty_Sense: No; $$NotCommonProperty_Status: None; CmpIndex: 236; Ref Designator: B5; SymIndex: 2108; $$NotCommonProperty_ComponentHeight: 0mm; $$NotCommonProperty_Footprint Ref: C100; $$NotCommonProperty_SMD: No; $$NotCommonProperty_Socket: No; Cell Name: C100; PackageDescription: 1mm Diameter SMD Pad; Part Name: SMD_PAD_D1MM; Part Number: SMD_PAD_D1MM; Orientation: 0 = 0
TP2 = C100: $$NotCommonProperty_Partition: Pads; Part Description: 1mm Diameter SMD Pad; $$Internal_Resolution: 00001mm; $$NotCommonProperty_Family: SMD Pad; $$NotCommonProperty_Mounted: No; $$NotCommonProperty_Pin Count: 1; $$NotCommonProperty_Sense: No; $$NotCommonProperty_Status: None; CmpIndex: 237; Ref Designator: B6; SymIndex: 2108; $$NotCommonProperty_ComponentHeight: 0mm; $$NotCommonProperty_Footprint Ref: C100; $$NotCommonProperty_SMD: No; $$NotCommonProperty_Socket: No; Cell Name: C100; PackageDescription: 1mm Diameter SMD Pad; Part Name: SMD_PAD_D1MM; Part Number: SMD_PAD_D1MM; Orientation: 0 = 0
TP3 = C100: $$NotCommonProperty_Partition: Pads; Part Description: 1mm Diameter SMD Pad; $$Internal_Resolution: 00001mm; $$NotCommonProperty_Family: SMD Pad; $$NotCommonProperty_Mounted: No; $$NotCommonProperty_Pin Count: 1; $$NotCommonProperty_Sense: No; $$NotCommonProperty_Status: None; CmpIndex: 238; Ref Designator: B7; SymIndex: 2108; $$NotCommonProperty_ComponentHeight: 0mm; $$NotCommonProperty_Footprint Ref: C100; $$NotCommonProperty_SMD: No; $$NotCommonProperty_Socket: No; Cell Name: C100; PackageDescription: 1mm Diameter SMD Pad; Part Name: SMD_PAD_D1MM; Part Number: SMD_PAD_D1MM; Orientation: 0 = 0
TP4 = C100: $$NotCommonProperty_Partition: Pads; Part Description: 1mm Diameter SMD Pad; $$Internal_Resolution: 00001mm; $$NotCommonProperty_Family: SMD Pad; $$NotCommonProperty_Mounted: No; $$NotCommonProperty_Pin Count: 1; $$NotCommonProperty_Sense: No; $$NotCommonProperty_Status: None; CmpIndex: 256; Ref Designator: B8; SymIndex: 2108; $$NotCommonProperty_ComponentHeight: 0mm; $$NotCommonProperty_Footprint Ref: C100; $$NotCommonProperty_SMD: No; $$NotCommonProperty_Socket: No; Cell Name: C100; PackageDescription: 1mm Diameter SMD Pad; Part Name: SMD_PAD_D1MM; Part Number: SMD_PAD_D1MM; Orientation: 0 = 0
TP5 = C100: $$NotCommonProperty_Partition: Pads; Part Description: 1mm Diameter SMD Pad; $$Internal_Resolution: 00001mm; $$NotCommonProperty_Family: SMD Pad; $$NotCommonProperty_Mounted: No; $$NotCommonProperty_Pin Count: 1; $$NotCommonProperty_Sense: No; $$NotCommonProperty_Status: None; CmpIndex: 257; Ref Designator: B9; SymIndex: 2108; $$NotCommonProperty_ComponentHeight: 0mm; $$NotCommonProperty_Footprint Ref: C100; $$NotCommonProperty_SMD: No; $$NotCommonProperty_Socket: No; Cell Name: C100; PackageDescription: 1mm Diameter SMD Pad; Part Name: SMD_PAD_D1MM; Part Number: SMD_PAD_D1MM; Orientation: 0 = 0
TP6 = C100: $$NotCommonProperty_Partition: Pads; Part Description: 1mm Diameter SMD Pad; $$Internal_Resolution: 00001mm; $$NotCommonProperty_Family: SMD Pad; $$NotCommonProperty_Mounted: No; $$NotCommonProperty_Pin Count: 1; $$NotCommonProperty_Sense: No; $$NotCommonProperty_Status: None; CmpIndex: 259; Ref Designator: B10; SymIndex: 2108; $$NotCommonProperty_ComponentHeight: 0mm; $$NotCommonProperty_Footprint Ref: C100; $$NotCommonProperty_SMD: No; $$NotCommonProperty_Socket: No; Cell Name: C100; PackageDescription: 1mm Diameter SMD Pad; Part Name: SMD_PAD_D1MM; Part Number: SMD_PAD_D1MM; Orientation: 0 = 0
TP7 = C100: $$NotCommonProperty_Partition: Pads; Part Description: 1mm Diameter SMD Pad; $$Internal_Resolution: 00001mm; $$NotCommonProperty_Family: SMD Pad; $$NotCommonProperty_Mounted: No; $$NotCommonProperty_Pin Count: 1; $$NotCommonProperty_Sense: No; $$NotCommonProperty_Status: None; CmpIndex: 261; Ref Designator: B11; SymIndex: 2108; $$NotCommonProperty_ComponentHeight: 0mm; $$NotCommonProperty_Footprint Ref: C100; $$NotCommonProperty_SMD: No; $$NotCommonProperty_Socket: No; Cell Name: C100; PackageDescription: 1mm Diameter SMD Pad; Part Name: SMD_PAD_D1MM; Part Number: SMD_PAD_D1MM; Orientation: 0 = 0

## Sheet CPU_LPC1776_SUP_PROG.SchDoc: Metlino
size 420 x 297 mm; CheckedBy: P.Kulik,T.Przywozki,W.Ruclo; Author: G.Kasprowicz; CompanyName: WUT ISE; DrawnBy: G.Kasprowicz; Organization: WUT ISE; Address1: PW ISE; Address2: Nowowiejska 15/19 00-665 Warsaw; Address3: gkasprow@gmail.com; DocumentNumber: 27; Revision: 2; SheetNumber: 27; SheetTotal: 29; ModifiedBy: -; CheckedDate: -; Title2: MMC - power & JTAG; DivGrp: WUT ISE; Designer: G.Kasprowicz; ModifiedDate: -; ProjectName: Sensor Box
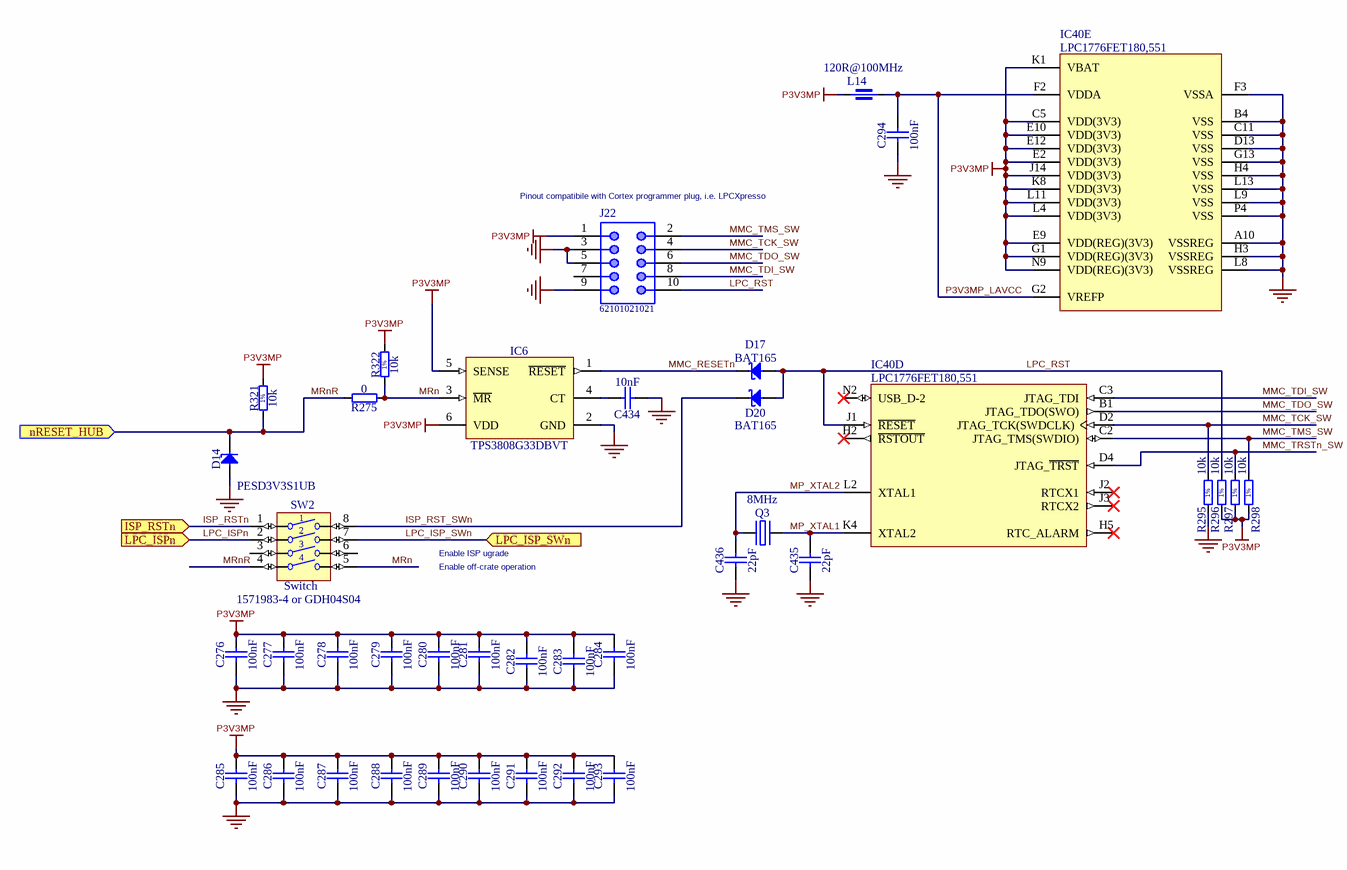
[diagram p19: CPU_LPC1776_SUP_PROG.SchDoc]

### Parts
C276  100nF  [CAPC0603X33N]
C277  100nF  [CAPC0603X33N]
C278  100nF  [CAPC0603X33N]
C279  100nF  [CAPC0603X33N]
C280  100nF  [CAPC0603X33N]
C281  100nF  [CAPC0603X33N]
C282  100nF  [CAPC0603X33N]
C283  100nF  [CAPC0603X33N]
C284  100nF  [CAPC0603X33N]
C285  100nF  [CAPC0603X33N]
C286  100nF  [CAPC0603X33N]
C287  100nF  [CAPC0603X33N]
C288  100nF  [CAPC0603X33N]
C289  100nF  [CAPC0603X33N]
C290  100nF  [CAPC0603X33N]
C291  100nF  [CAPC0603X33N]
C292  100nF  [CAPC0603X33N]
C293  100nF  [CAPC0603X33N]
C294  100nF  [CAPC0603X33N]
C434  10nF  [CAPC1005X55N]
C435  22pF  [CAPC1005X55N]
C436  22pF  [CAPC1005X55N]
D14  PESD3V3S1UB  [SODFL1608X65N]
D17  BAT165  [SOD2512X110N]
D20  BAT165  [SOD2512X110N]
IC6  TPS3808G33DBVT  [SOT95P280X145-6N]
IC40  LPC1776FET180,551  [BGA180C80P14X14_1200X1200X120]  (parts D,E of 5)
J22  62101021021  [62101021021]
L14  120R@100MHz  [INDC1608X95N]
Q3  8MHz  [XTAL_TXC_7A]
R275  0  [RESC1005X40N]
R295  10k  [RESC1005X40N]
R296  10k  [RESC1005X40N]
R297  10k  [RESC1005X40N]
R298  10k  [RESC1005X40N]
R321  10k  [RESC1005X40N]
R322  10k  [RESC1005X40N]
SW2  Switch  Manufacturer Part Number: 1571983-4 or GDH04S04  [SW_TYCO_1571983-4]

### Ports
ISP_RSTn (in), LPC_ISP_SWn (in), LPC_ISPn (in), nRESET_HUB (in)

### Nets
GND: C276.2 C277.2 C278.2 C279.2 C280.2 C281.2 C282.2 C283.2 C284.2 C285.2 C286.2 C287.2 C288.2 C289.2 C290.2 C291.2 C292.2 C293.2 C294.2 C434.1 C435.1 C436.1 D14.2(A) IC6.2(GND) IC40.A10(VSSREG) IC40.B4(VSS) IC40.C11(VSS) IC40.D13(VSS) IC40.F3(VSSA) IC40.G13(VSS) IC40.H3(VSSREG) IC40.H4(VSS) IC40.L8(VSSREG) IC40.L9(VSS) IC40.L13(VSS) IC40.P4(VSS) J22.3 J22.5 J22.9 R295.1
P3V3MP: C276.1 C277.1 C278.1 C279.1 C280.1 C281.1 C282.1 C283.1 C284.1 C285.1 C286.1 C287.1 C288.1 C289.1 C290.1 C291.1 C292.1 C293.1 IC6.5(SENSE) IC6.6(VDD) IC40.C5(VDD(3V3)) IC40.E2(VDD(3V3)) IC40.E9(VDD(REG)(3V3)) IC40.E10(VDD(3V3)) IC40.E12(VDD(3V3)) IC40.G1(VDD(REG)(3V3)) IC40.J14(VDD(3V3)) IC40.K1(VBAT) IC40.K8(VDD(3V3)) IC40.L4(VDD(3V3)) IC40.L11(VDD(3V3)) IC40.N9(VDD(REG)(3V3)) J22.1 L14.2 R296.1 R297.1 R298.1 R321.2 R322.2
ISP_RST_SWn: D20.1(C) SW2.8
ISP_RSTn: SW2.1 ; port ISP_RSTn
LPC_ISP_SWn: SW2.7 ; port LPC_ISP_SWn
LPC_ISPn: SW2.2 ; port LPC_ISPn
LPC_RST: D17.2(A) D20.2(A) IC40.J1(~{RESET}) J22.10 R296.2
MMC_RESETn: D17.1(C) IC6.1(~{RESET})
MMC_TCK_SW: IC40.D2(JTAG_TCK(SWDCLK)) J22.4 R295.2
MMC_TDI_SW: IC40.C3(JTAG_TDI) J22.8
MMC_TDO_SW: IC40.B1(JTAG_TDO(SWO)) J22.6
MMC_TMS_SW: IC40.C2(JTAG_TMS(SWDIO)) J22.2 R298.2
MMC_TRSTn_SW: IC40.D4(JTAG_~{TRST}) R297.2
MP_XTAL1: C435.2 IC40.K4(XTAL2) Q3.2(OSC2)
MP_XTAL2: C436.2 IC40.L2(XTAL1) Q3.1(OSC1)
MRn: IC6.3(~{MR}) R275.1 R322.1 SW2.5
MRnR: D14.1(C) R275.2 R321.1 SW2.4 ; port nRESET_HUB
P3V3MP_LAVCC: C294.1 IC40.F2(VDDA) IC40.G2(VREFP) L14.1
NetC434_2: C434.2 IC6.4(CT)

Not connected (* = marked no-connect by the designer): IC40 H2(~{RSTOUT})* H5(RTC_ALARM)* J2(RTCX1)* J3(RTCX2)* N2(USB_D-2)*; J22 7; SW2 3 6

### Notes on the sheet
- (near J22) Pinout compatibile with Cortex programmer plug, i.e. LPCXpresso
- Enable ISP ugrade
- Enable off-crate operation
- Project/Equipment
- Document
- Designer
- Drawn by
- Check.by
- Copyright WUT ISE 2018.
  This documentation describes Open Hardware and is licensed under the CERN OHL v.1.1. You may redistribute and modify this documentation under the terms of the CERN OHL v.1.1. (http://ohwr.org/CERNOHL). This documentation is distributed WITHOUT ANY EXPRESS OR IMPLIED WARRANTY, INCLUDING OF MERCHANTABILITY, SATISFACTORY QUALITY AND FITNESS FOR A PARTICULAR PURPOSE. Please see the CERN OHL v.1.1 for applicable conditions.
- Contact
- File
- Last Mod.
- Print Date
- Sheet
- Size
- A3
- of
- Rev
- (in symbol R0402_10K_1%_0.0625W_100PPM) 1%

### Library data of the parts
C276-C294 = CC0201_100NF_6.3V_10%_X5R: as C22 on sheet CPU_LPC1776; Manufacturer Part Number: CC0201_100NF_6.3V_10%_X5R; Part Number: CC0201_100NF_6.3V_10%_X5R; Value: 100nF; Component Kind: Standard; Component Type: Standard; Pin Count: 2; Status: Not Recommended; Case: 0201; Mounted: Yes; Socket: No; SMD: Yes; Sense: No; Manufacturer1 Example: AVX; Manufacturer1 ComponentHeight: 0.33mm; HelpURL: \\cern.ch\dfs\Applications\Altium\Datasheets\CC0201_X5R_AVX.pdf; Author: CERN DEM JLC; CreateDate: 03.12.2007; LatestRevisionDate: 03.12.2007
C434 = CC0402_10NF_16V_10%_X7R: Non-polarised capacitor; Manufacturer: GENERIC; Part Description: SMD Multilayer Chip Ceramic Capacitor; Manufacturer1 Part Number: 223878715636; Tolerance: ±10%; Voltage: 16V; TC: X7R; Manufacturer Part Number: CC0402_10NF_16V_10%_X7R; Part Number: CC0402_10NF_16V_10%_X7R; Value: 10nF; Component Kind: Standard; Component Type: Standard; Pin Count: 2; Status: Not Recommended; Case: 0402; Mounted: Yes; Socket: No; SMD: Yes; Sense: No; Manufacturer1 Example: PHYCOMP; Manufacturer1 ComponentHeight: 0.55mm; HelpURL: \\cern.ch\dfs\Applications\Altium\Datasheets\CC0402_X7R_PHYCOMP.pdf; Author: CERN DEM JLC; CreateDate: 03.12.2007; LatestRevisionDate: 03.12.2007
C435 C436 = CC0402_22PF_50V_5%_C0G: Non-polarised capacitor; Manufacturer: GENERIC; Part Description: SMD Multilayer Chip Ceramic Capacitor; Manufacturer1 Part Number: C0402C220J5GACTU; Tolerance: ±5%; Voltage: 50V; TC: C0G/NP0; Manufacturer Part Number: CC0402_22PF_50V_5%_C0G; Part Number: CC0402_22PF_50V_5%_C0G; Value: 22pF; Component Kind: Standard; Component Type: Standard; Pin Count: 2; Status: Preferred; Case: 0402; Mounted: Yes; Socket: No; SMD: Yes; Sense: No; Manufacturer1 Example: KEMET; Manufacturer1 ComponentHeight: 0.55mm; HelpURL: \\cern.ch\dfs\Applications\Altium\Datasheets\CC0805_C0G_KEMET_(Commercial Grade).pdf; Author: CERN DEM JLC; CreateDate: 03.12.2007; LatestRevisionDate: 03.12.2007
D14 = PESD3V3S1UB: as D8 on sheet CPU_LPC1776; Manufacturer Part Number: PESD3V3S1UB; PackageDescription: Ultra Small Outline Diode Flat Lead (SOD-523), Body; 1.2mm L X 0.8mm W X 0.65mm H, IPC Medium Density; Part Number: PESD3V3S1UB; Component Kind: Standard; Component Type: Standard; Device: PESD3V3S1UB; Pin Count: 2; Case: SOD523; Mounted: Yes; Socket: No; SMD: Yes; Sense: No; ComponentHeight: 0.65mm; HelpURL: \\cern.ch\dfs\Applications\Altium\Datasheets\PESD3V3S1UB.pdf; Author: CERN DEM JLC; CreateDate: 29.11.2012; LatestRevisionDate: 29.11.2012
D17 D20 = BAT165: Schottky Diode; Manufacturer: INFINEON; Part Description: Medium Power AF Schottky Diode; Voltage: 40V; Power: 750mA; PressFit: No; Bonding: No; Manufacturer Part Number: BAT165; PackageDescription: Small Outline Diode (SOD-323), 1.70mm W X 1.25mm L X 1.10mm H body,  IPC Medium Density; Part Number: BAT165; Component Kind: Standard; Component Type: Standard; Device: BAT165; Pin Count: 2; Case: SOD323; Mounted: Yes; Socket: No; SMD: Yes; Sense: No; ComponentHeight: 1.1mm; HelpURL: \\cern.ch\dfs\Applications\Altium\Datasheets\BAT165.pdf; Author: CERN DEM JLC; CreateDate: 12.11.2014; LatestRevisionDate: 12.11.2014
IC6 = TPS3808G33DBVT: Low Quiescent Current, Programmable-Delay Supervisory Circuit; Manufacturer: TEXAS INSTRUMENTS; Part Description: 3.3V, Low Quiescent Current, Programmable-Delay Supervisory Circuit; PressFit: No; Bonding: No; Manufacturer Part Number: TPS3808G33DBVT; PackageDescription: SOT23, 6-Leads, Body 1.6x3.0mm, Pitch 0.95mm, IPC Medium Density; Part Number: TPS3808G33DBVT; Component Kind: Standard; Component Type: Standard; Device: TPS3808G33DBVT; Pin Count: 6; Case: SOT23-6; Mounted: Yes; Socket: No; SMD: Yes; Sense: No; ComponentHeight: 1.45mm; Author: CERN DEM JLC; HelpURL: \\cern.ch\dfs\Applications\Altium\Datasheets\TPS3808G33DBVT.pdf; CreateDate: 05.11.2013; LatestRevisionDate: 05.11.2013
IC40 = LPC1776FET180,551: as IC40 on sheet CPU_LPC1776; Manufacturer Part Number: LPC1776FET180,551; PackageDescription: BGA, 0.80mm Pitch, Square; 180 Pin, 14 Columns X 14 Rows, Body 12.00mm X 12.00mm X 1.20mm H, IPC Medium Density; Part Number: LPC1776FET180,551; Component Kind: Standard; Component Type: Standard; Device: LPC1776FET180,551; Pin Count: 180; Case: BGA180; Mounted: Yes; Socket: No; SMD: Yes; Sense: No; ComponentHeight: 1.2mm; HelpURL: \\cern.ch\dfs\Applications\Altium\Datasheets\LPC1776FET180,551.pdf; Author: CERN DEM JMW; CreateDate: 16.08.2016; LatestRevisionDate: 16.08.2016
J22 = 62101021021: SMT Vertical Pin Header WR-PHD, Pitch 1.27 mm, Dual Row, 10 pins; Pin Number: 10; Pitch: 1.27 mm; Gender: Male; Rated Current: 1 A; Working Voltage: 100 VAC; Withstanding Voltage: 500 VAC; Contact Resistance: 20 mOhm; ComponentLink1Description: Manufacturer; ComponentLink1URL: http://www.we-online.de; ComponentLink2Description: Datasheet; ComponentLink2URL: https://katalog.we-online.de/em/datasheet/62101021021.pdf; Part Number: 62101021021; Published Date: August 2018; Publisher: Wurth Elektronik; Operating Temperature: -40 to 105 degC; Mounting Technology: SMT; Packaging: Tube; Row Number: Dual; Orientation: Vertical
L14 = IND0603_MURATA_BLM18PG121SN1D: Manufacturer: MURATA; Part Description: SMD EMIFIL Chip Ferrite Bead; Power: 2A; Resistance: 0.05R; Manufacturer Part Number: BLM18PG121SN1D; Part Number: IND0603_MURATA_BLM18PG121SN1D; Value: 120R@100MHz; Component Kind: Standard; Component Type: Standard; Pin Count: 2; Status: None; Case: 0603; Mounted: Yes; Socket: No; SMD: Yes; Sense: No; ComponentHeight: 0.95mm; HelpURL: \\cern.ch\dfs\Applications\Altium\Datasheets\IND0603_MURATA_BLM18P.pdf; Author: CERN DEM BC; CreateDate: 27.07.2015; LatestRevisionDate: 25.10.2018
Q3 = XTAL_8MHZ_TXC_7A-8.000MAAE-T: Quartz Crystal; Manufacturer: TXC CORPORATION; Part Description: Tolerance: ±30ppm, Stability: ±30ppm, -20°C to +70°C, 12pF, SMD Glass Seam Sealing Crystal, 7A Series; PressFit: No; Bonding: No; Manufacturer Part Number: 7A-8.000MAAE-T; PackageDescription: 2 Pins, 3.2x5mm, SMD Glass Seam Sealing Crystal, 7A Serie; Part Number: XTAL_8MHZ_TXC_7A-8.000MAAE-T; Value: 8MHz; Component Kind: Standard; Component Type: Standard; Pin Count: 2; Mounted: Yes; Socket: No; SMD: Yes; Sense: No; ComponentHeight: 1.2mm; HelpURL: \\cern.ch\dfs\Applications\Altium\Datasheets\XTAL_TXC_7A.pdf; Author: CERN DEM JLC; CreateDate: 09.10.2014; LatestRevisionDate: 12.11.2014
R275 = R0402_0R_JUMPER: as R305 on sheet CPU_LPC1776; Manufacturer Part Number: R0402_0R_JUMPER; Part Number: R0402_0R_JUMPER; Value: 0; Component Kind: Standard; Component Type: Standard; Pin Count: 2; Status: Not Recommended; Case: 0402; Mounted: Yes; Sense: No; Socket: No; SMD: Yes; Manufacturer1 Example: YAGEO PHYCOMP; Manufacturer1 ComponentHeight: 0.4mm; HelpURL: \\cern.ch\dfs\Applications\Altium\Datasheets\R0402_Phycomp_RC0402.pdf; Author: CERN DEM JLC; CreateDate: 03.12.2007; LatestRevisionDate: 17.10.2012
R295-R298 R321 R322 = R0402_10K_1%_0.0625W_100PPM: as R292 on sheet CPU_LPC1776; Manufacturer Part Number: R0402_10K_1%_0.0625W_100PPM; Part Number: R0402_10K_1%_0.0625W_100PPM; Tolerance: ±1%; Value: 10k; Component Kind: Standard; Component Type: Standard; Pin Count: 2; Status: Not Recommended; Power: 0.0625W; Case: 0402; Mounted: Yes; Sense: No; Socket: No; SMD: Yes; Manufacturer1 Example: YAGEO PHYCOMP; Manufacturer1 ComponentHeight: 0.4mm; HelpURL: \\cern.ch\dfs\Applications\Altium\Datasheets\R0402_Phycomp_RC0402.pdf; Author: CERN DEM JLC; CreateDate: 03.12.2007; LatestRevisionDate: 17.10.2012
SW2 = SW_TYCO_1571983-4: 4 Ways SPST DIP Switch; Manufacturer: TYCO; Part Description: 4 Way SPST SMD DIP Switch, Latched, Contact Rating 0.025A 24VDC; PressFit: No; PackageDescription: Pitch 1.27mm,  Body 6.2x6.2mm, 4 Ways SPST Surface-Mount DIP Switch, TYCO GDH Series; Part Number: SW_TYCO_1571983-4; Component Kind: Standard; Component Type: Standard; Pin Count: 8; Family: Switch; Mounted: Yes; Socket: No; SMD: Yes; Sense: No; Status: None; ComponentHeight: 2.31mm; HelpURL: \\cern.ch\dfs\Applications\Altium\Datasheets\SW_TYCO_1571983-4.pdf; Author: CERN DEM JLC; CreateDate: 08.01.2009; LatestRevisionDate: 08.01.2009